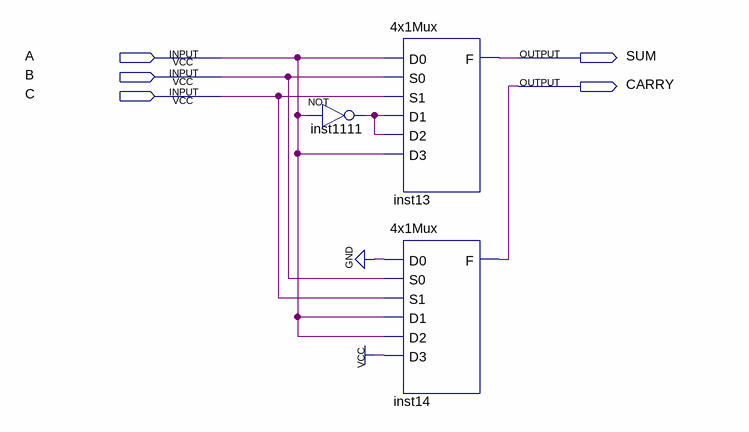
[diagram p0: schematic sheet]
// Quartus schematic fullAdderMUX.bdf as structural Verilog: 3 symbols, 5 pins
module fullAdderMUX (
  input  A,
  input  B,
  input  C,
  output SUM,
  output CARRY
);

  wire inst1111_out;

  not inst1111 (inst1111_out, A);
  \4x1Mux  inst13 (.D0(A), .S0(B), .S1(C), .D1(inst1111_out), .D2(inst1111_out), .D3(A), .F(SUM));
  \4x1Mux  inst14 (.D0(1'b0), .S0(B), .S1(C), .D1(A), .D2(A), .D3(1'b1), .F(CARRY));
endmodule
